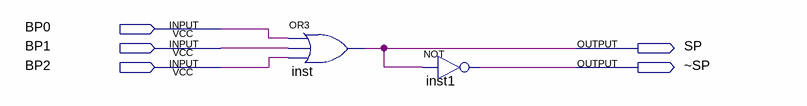
[diagram p0: schematic sheet]
// Quartus schematic Preferencia_Elevador.bdf as structural Verilog: 2 symbols, 5 pins
module Preferencia_Elevador (
  input  BP0,
  input  BP1,
  input  BP2,
  output SP,
  output \~SP 
);

  or inst (SP, BP0, BP1, BP2);
  not inst1 (\~SP , SP);
endmodule
